# EasyEDA schematic 1-Schematic_Vitulus-connector_main_unit.json
TITLE: Sheet_1; REV: 1.0; Date: 2020-12-14; Sheet: 1/1; Drawn By: robert.lacina; Company: Your Company
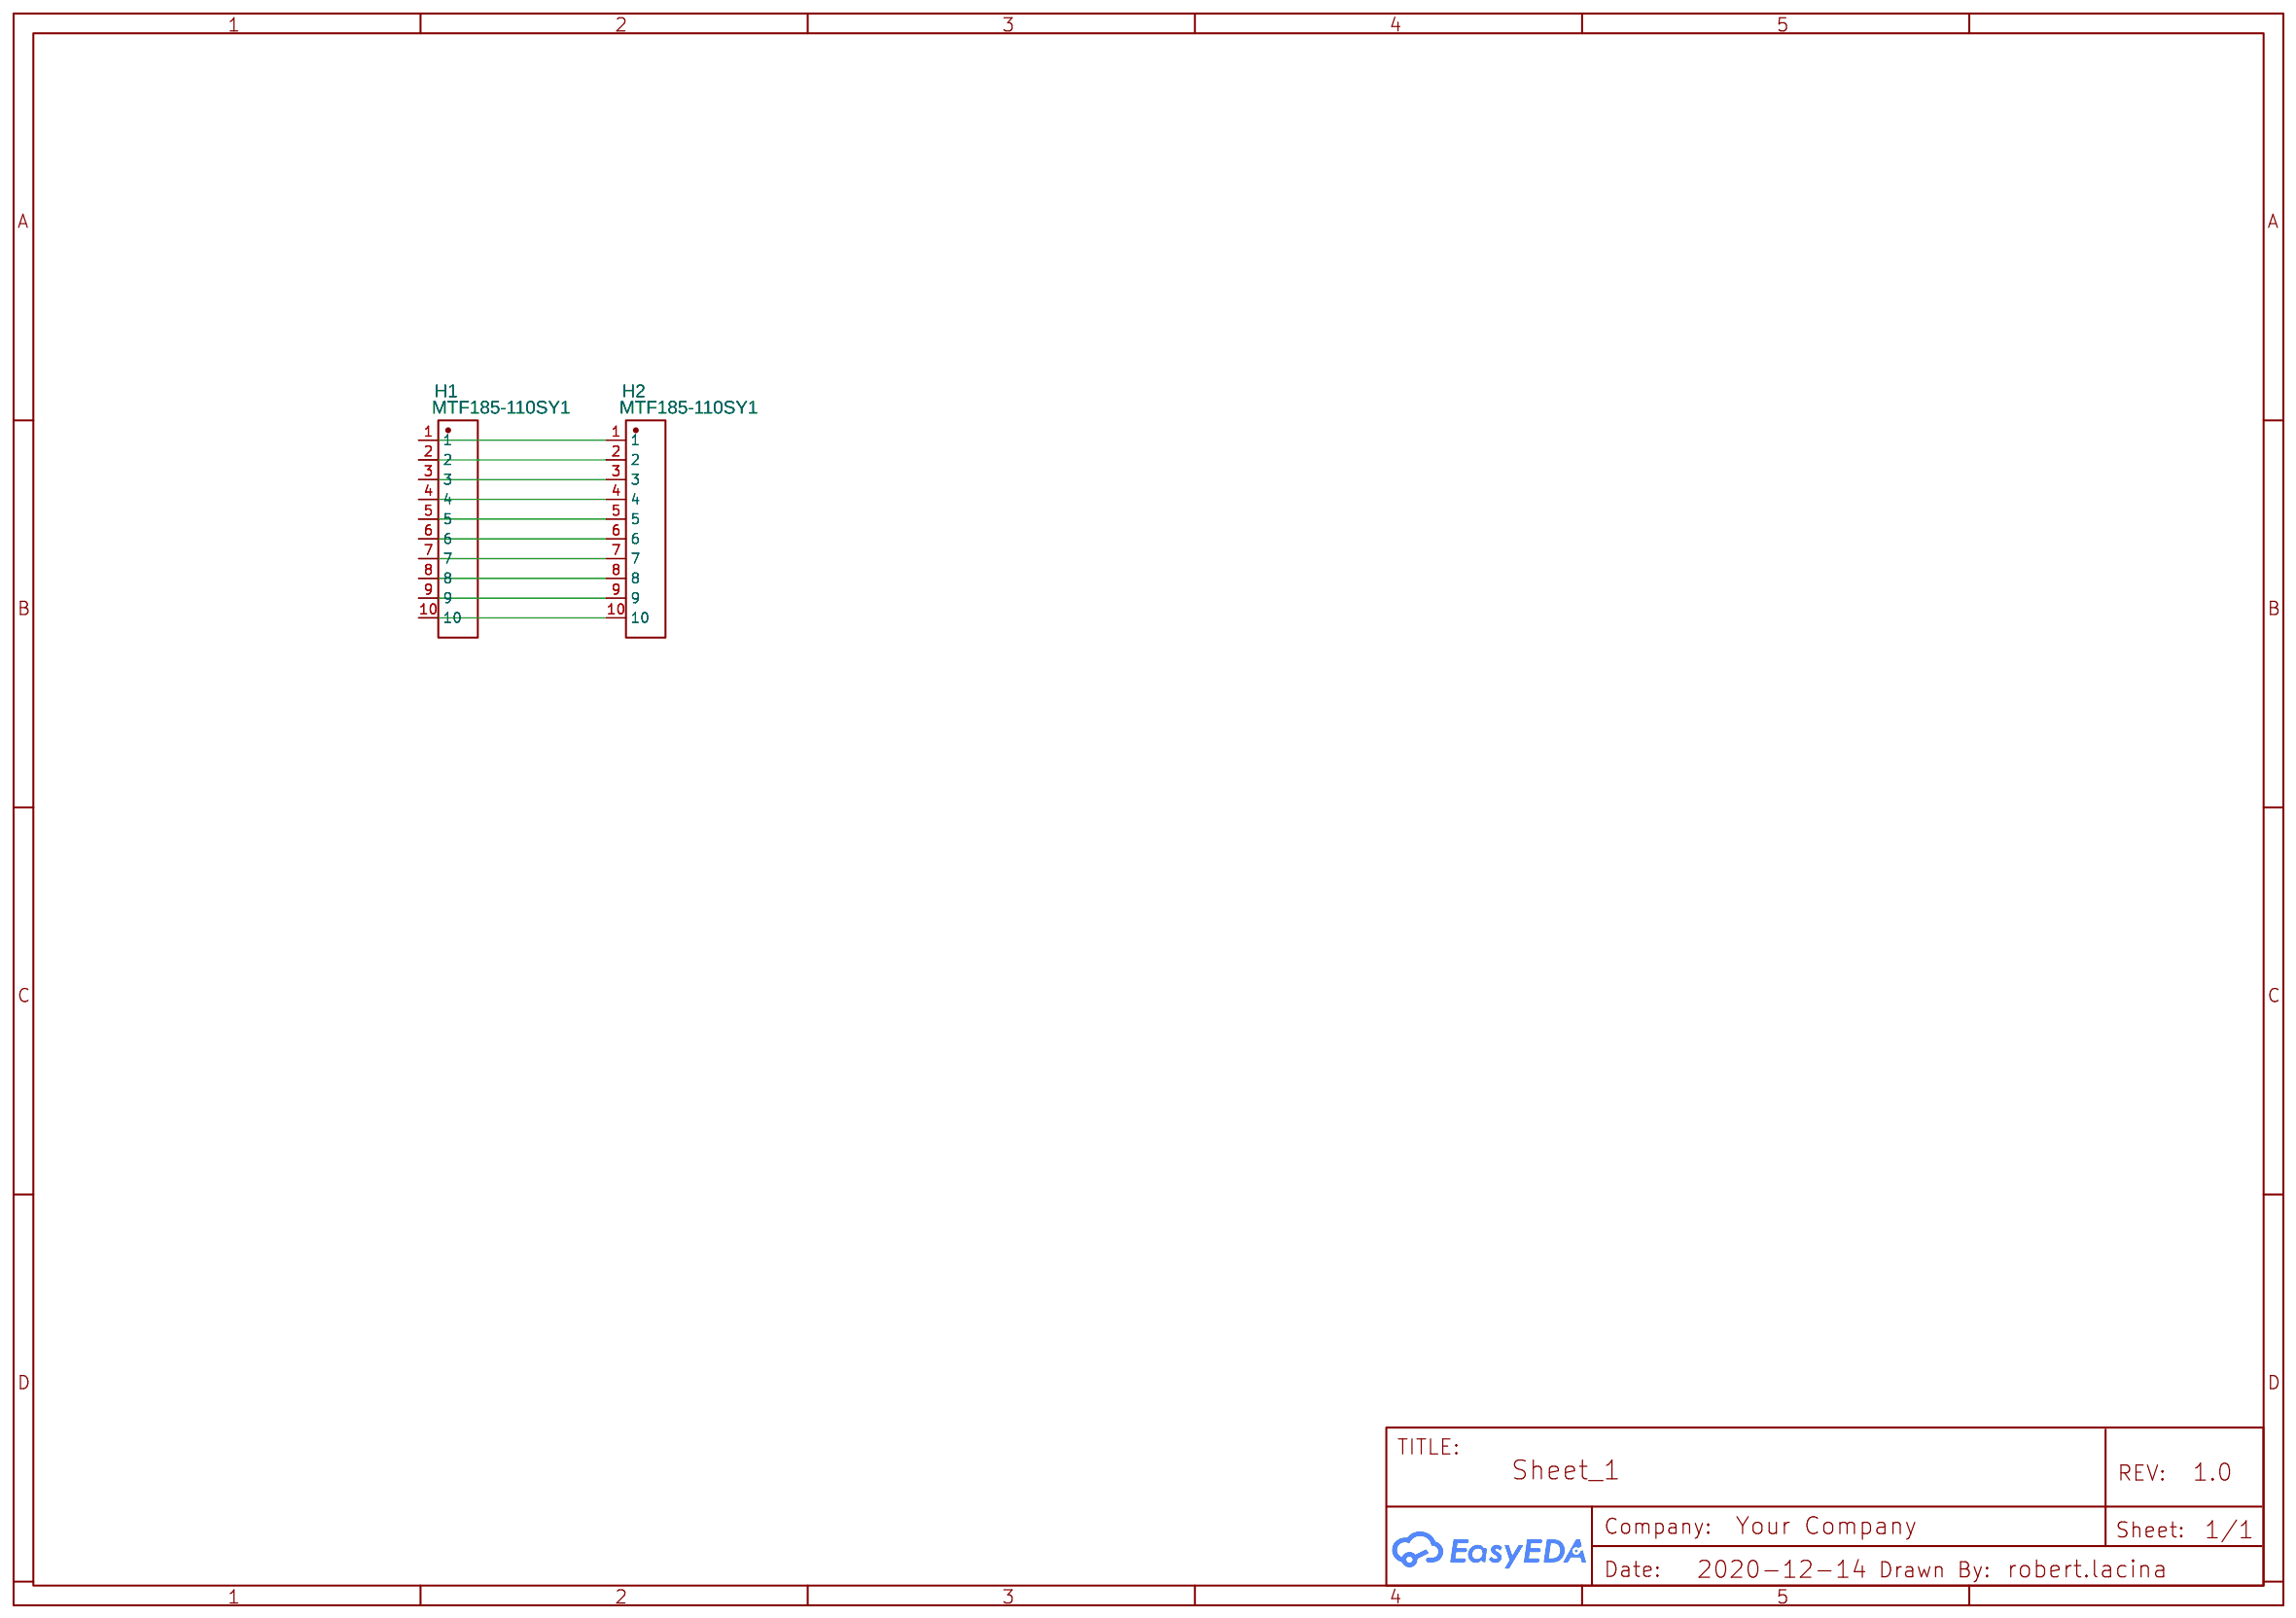
[diagram p0: schematic sheet]

## Parts
H1  MTF185-110SY1  [HDR-TH_10P-P2.54-V]
H2  MTF185-110SY1  [HDR-TH_10P-P2.54-V]

## Library data of the parts
H1 H2 = MTF185-110SY1: Supplier: LCSC; Supplier Part: C358723; Manufacturer: MINTRON; Contributor: LCSC

## Nets
Net-(H1-1): H1.1 H2.1
Net-(H1-2): H1.2 H2.2
Net-(H1-3): H1.3 H2.3
Net-(H1-4): H1.4 H2.4
Net-(H1-5): H1.5 H2.5
Net-(H1-6): H1.6 H2.6
Net-(H1-7): H1.7 H2.7
Net-(H1-8): H1.8 H2.8
Net-(H1-9): H1.9 H2.9
Net-(H1-10): H1.10 H2.10
